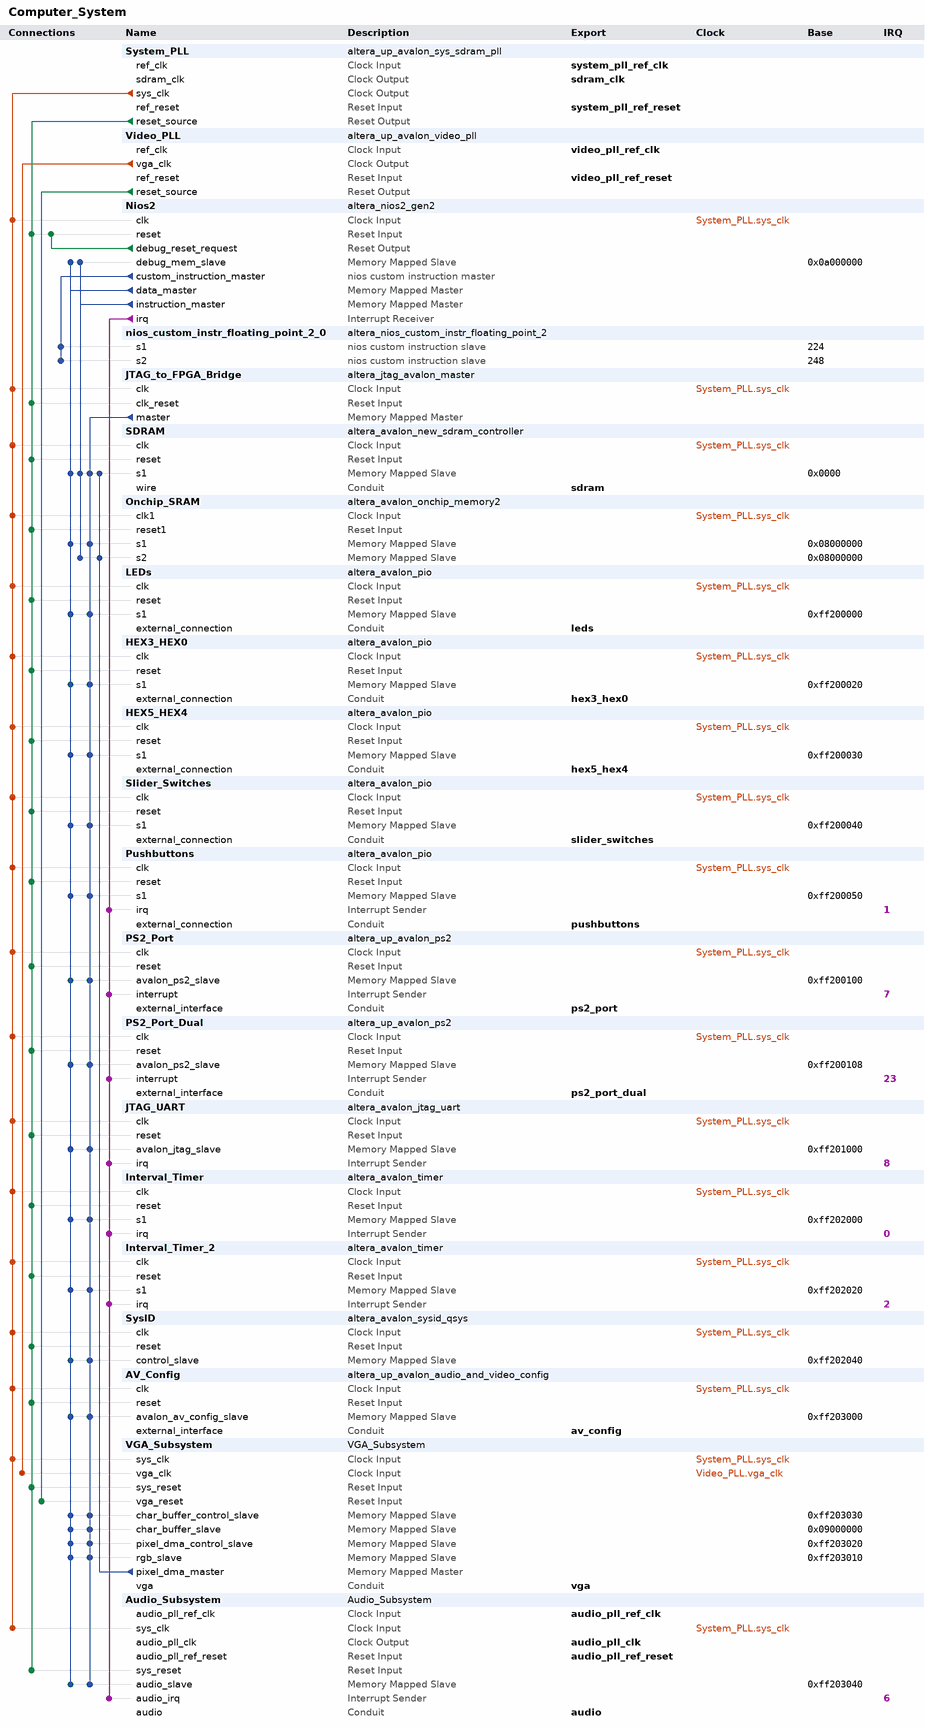
[diagram p0: system contents]
# Platform Designer (Qsys) system Computer_System, Cyclone V 5CSEMA5F31C6
# Parameters at their usual value, and those the tool derives, are not listed.
package require -exact qsys 18.1
create_system Computer_System
set_project_property DEVICE_FAMILY {Cyclone V}
set_project_property DEVICE 5CSEMA5F31C6

add_instance System_PLL altera_up_avalon_sys_sdram_pll 18.0
set_instance_parameter_value System_PLL CV_boards DE1-SoC
set_instance_parameter_value System_PLL gui_outclk 100.0
set_instance_parameter_value System_PLL gui_refclk 50.0

add_instance Video_PLL altera_up_avalon_video_pll 18.0
set_instance_parameter_value Video_PLL camera {5MP Digital Camera (THDB_D5M)}
set_instance_parameter_value Video_PLL gui_refclk 50.0
set_instance_parameter_value Video_PLL lcd {7" LCD on VEEK-MT and MTL/MTL2 Modules}

add_instance Nios2 altera_nios2_gen2 18.1
set_instance_parameter_value Nios2 dcache_size 0
set_instance_parameter_value Nios2 debug_datatrigger 2
set_instance_parameter_value Nios2 debug_hwbreakpoint 2
set_instance_parameter_value Nios2 debug_traceType instruction_trace
set_instance_parameter_value Nios2 dividerType srt2
set_instance_parameter_value Nios2 exceptionSlave SDRAM.s1
set_instance_parameter_value Nios2 icache_size 4096
set_instance_parameter_value Nios2 impl Fast
set_instance_parameter_value Nios2 mul_64_impl 1
set_instance_parameter_value Nios2 mul_shift_choice 1
set_instance_parameter_value Nios2 resetSlave SDRAM.s1
set_instance_parameter_value Nios2 resetrequest_enabled false
set_instance_parameter_value Nios2 setting_support31bitdcachebypass false

add_instance nios_custom_instr_floating_point_2_0 altera_nios_custom_instr_floating_point_2 18.1
set_instance_parameter_value nios_custom_instr_floating_point_2_0 arithmetic_present true
set_instance_parameter_value nios_custom_instr_floating_point_2_0 comparison_present true
set_instance_parameter_value nios_custom_instr_floating_point_2_0 conversion_present true
set_instance_parameter_value nios_custom_instr_floating_point_2_0 root_present true

add_instance JTAG_to_FPGA_Bridge altera_jtag_avalon_master 18.1

add_instance SDRAM altera_avalon_new_sdram_controller 18.1
set_instance_parameter_value SDRAM TAC 5.5
set_instance_parameter_value SDRAM TRCD 20.0
set_instance_parameter_value SDRAM TRP 20.0
set_instance_parameter_value SDRAM casLatency 3
set_instance_parameter_value SDRAM columnWidth 10
set_instance_parameter_value SDRAM dataWidth 16
set_instance_parameter_value SDRAM generateSimulationModel true
set_instance_parameter_value SDRAM model single_Micron_MT48LC4M32B2_7_chip
set_instance_parameter_value SDRAM numberOfBanks 4
set_instance_parameter_value SDRAM numberOfChipSelects 1
set_instance_parameter_value SDRAM powerUpDelay 100.0
set_instance_parameter_value SDRAM refreshPeriod 15.625
set_instance_parameter_value SDRAM rowWidth 13

add_instance Onchip_SRAM altera_avalon_onchip_memory2 18.1
set_instance_parameter_value Onchip_SRAM dataWidth 32
set_instance_parameter_value Onchip_SRAM dualPort true
set_instance_parameter_value Onchip_SRAM initMemContent true
set_instance_parameter_value Onchip_SRAM initializationFileName onchip_mem.hex
set_instance_parameter_value Onchip_SRAM memorySize 262144
set_instance_parameter_value Onchip_SRAM singleClockOperation true

add_instance LEDs altera_avalon_pio 18.1
set_instance_parameter_value LEDs direction Output
set_instance_parameter_value LEDs width 10

add_instance HEX3_HEX0 altera_avalon_pio 18.1
set_instance_parameter_value HEX3_HEX0 direction Output
set_instance_parameter_value HEX3_HEX0 width 32

add_instance HEX5_HEX4 altera_avalon_pio 18.1
set_instance_parameter_value HEX5_HEX4 direction Output
set_instance_parameter_value HEX5_HEX4 width 16

add_instance Slider_Switches altera_avalon_pio 18.1
set_instance_parameter_value Slider_Switches direction Input
set_instance_parameter_value Slider_Switches simDoTestBenchWiring true
set_instance_parameter_value Slider_Switches width 10

add_instance Pushbuttons altera_avalon_pio 18.1
set_instance_parameter_value Pushbuttons bitClearingEdgeCapReg true
set_instance_parameter_value Pushbuttons captureEdge true
set_instance_parameter_value Pushbuttons direction Input
set_instance_parameter_value Pushbuttons edgeType FALLING
set_instance_parameter_value Pushbuttons generateIRQ true
set_instance_parameter_value Pushbuttons irqType EDGE
set_instance_parameter_value Pushbuttons simDoTestBenchWiring true
set_instance_parameter_value Pushbuttons width 4

add_instance PS2_Port altera_up_avalon_ps2 18.0

add_instance PS2_Port_Dual altera_up_avalon_ps2 18.0

add_instance JTAG_UART altera_avalon_jtag_uart 18.1
set_instance_parameter_value JTAG_UART simInteractiveOptions NO_INTERACTIVE_WINDOWS

add_instance Interval_Timer altera_avalon_timer 18.1
set_instance_parameter_value Interval_Timer period 125.0
set_instance_parameter_value Interval_Timer periodUnits MSEC

add_instance Interval_Timer_2 altera_avalon_timer 18.1
set_instance_parameter_value Interval_Timer_2 period 125.0
set_instance_parameter_value Interval_Timer_2 periodUnits MSEC

add_instance SysID altera_avalon_sysid_qsys 18.1
set_instance_parameter_value SysID id 0

add_instance AV_Config altera_up_avalon_audio_and_video_config 18.0
set_instance_parameter_value AV_Config audio_in {Microphone to ADC}
set_instance_parameter_value AV_Config bit_length 32
set_instance_parameter_value AV_Config board DE1-SoC
set_instance_parameter_value AV_Config line_in_bypass true
set_instance_parameter_value AV_Config sampling_rate {8 kHz}

add_instance VGA_Subsystem VGA_Subsystem 1.0

add_instance Audio_Subsystem Audio_Subsystem 1.0

# connections
add_connection System_PLL.sys_clk Audio_Subsystem.sys_clk clock
add_connection System_PLL.sys_clk AV_Config.clk clock
add_connection System_PLL.sys_clk HEX3_HEX0.clk clock
add_connection System_PLL.sys_clk HEX5_HEX4.clk clock
add_connection System_PLL.sys_clk Interval_Timer.clk clock
add_connection System_PLL.sys_clk Interval_Timer_2.clk clock
add_connection System_PLL.sys_clk JTAG_to_FPGA_Bridge.clk clock
add_connection System_PLL.sys_clk JTAG_UART.clk clock
add_connection System_PLL.sys_clk LEDs.clk clock
add_connection System_PLL.sys_clk Nios2.clk clock
add_connection System_PLL.sys_clk Onchip_SRAM.clk1 clock
add_connection System_PLL.sys_clk PS2_Port.clk clock
add_connection System_PLL.sys_clk PS2_Port_Dual.clk clock
add_connection System_PLL.sys_clk Pushbuttons.clk clock
add_connection System_PLL.sys_clk SDRAM.clk clock
add_connection System_PLL.sys_clk Slider_Switches.clk clock
add_connection System_PLL.sys_clk SysID.clk clock
add_connection System_PLL.sys_clk VGA_Subsystem.sys_clk clock
add_connection Video_PLL.vga_clk VGA_Subsystem.vga_clk clock
add_connection Nios2.debug_reset_request Nios2.reset reset
add_connection System_PLL.reset_source Audio_Subsystem.sys_reset reset
add_connection System_PLL.reset_source AV_Config.reset reset
add_connection System_PLL.reset_source HEX3_HEX0.reset reset
add_connection System_PLL.reset_source HEX5_HEX4.reset reset
add_connection System_PLL.reset_source Interval_Timer.reset reset
add_connection System_PLL.reset_source Interval_Timer_2.reset reset
add_connection System_PLL.reset_source JTAG_to_FPGA_Bridge.clk_reset reset
add_connection System_PLL.reset_source JTAG_UART.reset reset
add_connection System_PLL.reset_source LEDs.reset reset
add_connection System_PLL.reset_source Nios2.reset reset
add_connection System_PLL.reset_source Onchip_SRAM.reset1 reset
add_connection System_PLL.reset_source PS2_Port.reset reset
add_connection System_PLL.reset_source PS2_Port_Dual.reset reset
add_connection System_PLL.reset_source Pushbuttons.reset reset
add_connection System_PLL.reset_source SDRAM.reset reset
add_connection System_PLL.reset_source Slider_Switches.reset reset
add_connection System_PLL.reset_source SysID.reset reset
add_connection System_PLL.reset_source VGA_Subsystem.sys_reset reset
add_connection Video_PLL.reset_source VGA_Subsystem.vga_reset reset
add_connection JTAG_to_FPGA_Bridge.master Audio_Subsystem.audio_slave avalon
set_connection_parameter_value JTAG_to_FPGA_Bridge.master/Audio_Subsystem.audio_slave baseAddress 0xff203040
add_connection JTAG_to_FPGA_Bridge.master AV_Config.avalon_av_config_slave avalon
set_connection_parameter_value JTAG_to_FPGA_Bridge.master/AV_Config.avalon_av_config_slave baseAddress 0xff203000
add_connection JTAG_to_FPGA_Bridge.master HEX3_HEX0.s1 avalon
set_connection_parameter_value JTAG_to_FPGA_Bridge.master/HEX3_HEX0.s1 baseAddress 0xff200020
add_connection JTAG_to_FPGA_Bridge.master HEX5_HEX4.s1 avalon
set_connection_parameter_value JTAG_to_FPGA_Bridge.master/HEX5_HEX4.s1 baseAddress 0xff200030
add_connection JTAG_to_FPGA_Bridge.master Interval_Timer.s1 avalon
set_connection_parameter_value JTAG_to_FPGA_Bridge.master/Interval_Timer.s1 baseAddress 0xff202000
add_connection JTAG_to_FPGA_Bridge.master Interval_Timer_2.s1 avalon
set_connection_parameter_value JTAG_to_FPGA_Bridge.master/Interval_Timer_2.s1 baseAddress 0xff202020
add_connection JTAG_to_FPGA_Bridge.master JTAG_UART.avalon_jtag_slave avalon
set_connection_parameter_value JTAG_to_FPGA_Bridge.master/JTAG_UART.avalon_jtag_slave baseAddress 0xff201000
add_connection JTAG_to_FPGA_Bridge.master LEDs.s1 avalon
set_connection_parameter_value JTAG_to_FPGA_Bridge.master/LEDs.s1 baseAddress 0xff200000
add_connection JTAG_to_FPGA_Bridge.master Onchip_SRAM.s1 avalon
set_connection_parameter_value JTAG_to_FPGA_Bridge.master/Onchip_SRAM.s1 baseAddress 0x08000000
add_connection JTAG_to_FPGA_Bridge.master PS2_Port.avalon_ps2_slave avalon
set_connection_parameter_value JTAG_to_FPGA_Bridge.master/PS2_Port.avalon_ps2_slave baseAddress 0xff200100
add_connection JTAG_to_FPGA_Bridge.master PS2_Port_Dual.avalon_ps2_slave avalon
set_connection_parameter_value JTAG_to_FPGA_Bridge.master/PS2_Port_Dual.avalon_ps2_slave baseAddress 0xff200108
add_connection JTAG_to_FPGA_Bridge.master Pushbuttons.s1 avalon
set_connection_parameter_value JTAG_to_FPGA_Bridge.master/Pushbuttons.s1 baseAddress 0xff200050
add_connection JTAG_to_FPGA_Bridge.master SDRAM.s1 avalon
set_connection_parameter_value JTAG_to_FPGA_Bridge.master/SDRAM.s1 baseAddress 0x0000
add_connection JTAG_to_FPGA_Bridge.master Slider_Switches.s1 avalon
set_connection_parameter_value JTAG_to_FPGA_Bridge.master/Slider_Switches.s1 baseAddress 0xff200040
add_connection JTAG_to_FPGA_Bridge.master SysID.control_slave avalon
set_connection_parameter_value JTAG_to_FPGA_Bridge.master/SysID.control_slave baseAddress 0xff202040
add_connection JTAG_to_FPGA_Bridge.master VGA_Subsystem.char_buffer_control_slave avalon
set_connection_parameter_value JTAG_to_FPGA_Bridge.master/VGA_Subsystem.char_buffer_control_slave baseAddress 0xff203030
add_connection JTAG_to_FPGA_Bridge.master VGA_Subsystem.char_buffer_slave avalon
set_connection_parameter_value JTAG_to_FPGA_Bridge.master/VGA_Subsystem.char_buffer_slave baseAddress 0x09000000
add_connection JTAG_to_FPGA_Bridge.master VGA_Subsystem.pixel_dma_control_slave avalon
set_connection_parameter_value JTAG_to_FPGA_Bridge.master/VGA_Subsystem.pixel_dma_control_slave baseAddress 0xff203020
add_connection JTAG_to_FPGA_Bridge.master VGA_Subsystem.rgb_slave avalon
set_connection_parameter_value JTAG_to_FPGA_Bridge.master/VGA_Subsystem.rgb_slave baseAddress 0xff203010
add_connection Nios2.data_master Audio_Subsystem.audio_slave avalon
set_connection_parameter_value Nios2.data_master/Audio_Subsystem.audio_slave baseAddress 0xff203040
add_connection Nios2.data_master AV_Config.avalon_av_config_slave avalon
set_connection_parameter_value Nios2.data_master/AV_Config.avalon_av_config_slave baseAddress 0xff203000
add_connection Nios2.data_master HEX3_HEX0.s1 avalon
set_connection_parameter_value Nios2.data_master/HEX3_HEX0.s1 baseAddress 0xff200020
add_connection Nios2.data_master HEX5_HEX4.s1 avalon
set_connection_parameter_value Nios2.data_master/HEX5_HEX4.s1 baseAddress 0xff200030
add_connection Nios2.data_master Interval_Timer.s1 avalon
set_connection_parameter_value Nios2.data_master/Interval_Timer.s1 baseAddress 0xff202000
add_connection Nios2.data_master Interval_Timer_2.s1 avalon
set_connection_parameter_value Nios2.data_master/Interval_Timer_2.s1 baseAddress 0xff202020
add_connection Nios2.data_master JTAG_UART.avalon_jtag_slave avalon
set_connection_parameter_value Nios2.data_master/JTAG_UART.avalon_jtag_slave baseAddress 0xff201000
add_connection Nios2.data_master LEDs.s1 avalon
set_connection_parameter_value Nios2.data_master/LEDs.s1 baseAddress 0xff200000
add_connection Nios2.data_master Nios2.debug_mem_slave avalon
set_connection_parameter_value Nios2.data_master/Nios2.debug_mem_slave baseAddress 0x0a000000
add_connection Nios2.data_master Onchip_SRAM.s1 avalon
set_connection_parameter_value Nios2.data_master/Onchip_SRAM.s1 baseAddress 0x08000000
add_connection Nios2.data_master PS2_Port.avalon_ps2_slave avalon
set_connection_parameter_value Nios2.data_master/PS2_Port.avalon_ps2_slave baseAddress 0xff200100
add_connection Nios2.data_master PS2_Port_Dual.avalon_ps2_slave avalon
set_connection_parameter_value Nios2.data_master/PS2_Port_Dual.avalon_ps2_slave baseAddress 0xff200108
add_connection Nios2.data_master Pushbuttons.s1 avalon
set_connection_parameter_value Nios2.data_master/Pushbuttons.s1 baseAddress 0xff200050
add_connection Nios2.data_master SDRAM.s1 avalon
set_connection_parameter_value Nios2.data_master/SDRAM.s1 baseAddress 0x0000
add_connection Nios2.data_master Slider_Switches.s1 avalon
set_connection_parameter_value Nios2.data_master/Slider_Switches.s1 baseAddress 0xff200040
add_connection Nios2.data_master SysID.control_slave avalon
set_connection_parameter_value Nios2.data_master/SysID.control_slave baseAddress 0xff202040
add_connection Nios2.data_master VGA_Subsystem.char_buffer_control_slave avalon
set_connection_parameter_value Nios2.data_master/VGA_Subsystem.char_buffer_control_slave baseAddress 0xff203030
add_connection Nios2.data_master VGA_Subsystem.char_buffer_slave avalon
set_connection_parameter_value Nios2.data_master/VGA_Subsystem.char_buffer_slave baseAddress 0x09000000
add_connection Nios2.data_master VGA_Subsystem.pixel_dma_control_slave avalon
set_connection_parameter_value Nios2.data_master/VGA_Subsystem.pixel_dma_control_slave baseAddress 0xff203020
add_connection Nios2.data_master VGA_Subsystem.rgb_slave avalon
set_connection_parameter_value Nios2.data_master/VGA_Subsystem.rgb_slave baseAddress 0xff203010
add_connection Nios2.instruction_master Nios2.debug_mem_slave avalon
set_connection_parameter_value Nios2.instruction_master/Nios2.debug_mem_slave baseAddress 0x0a000000
add_connection Nios2.instruction_master Onchip_SRAM.s2 avalon
set_connection_parameter_value Nios2.instruction_master/Onchip_SRAM.s2 baseAddress 0x08000000
add_connection Nios2.instruction_master SDRAM.s1 avalon
set_connection_parameter_value Nios2.instruction_master/SDRAM.s1 baseAddress 0x0000
add_connection VGA_Subsystem.pixel_dma_master Onchip_SRAM.s2 avalon
set_connection_parameter_value VGA_Subsystem.pixel_dma_master/Onchip_SRAM.s2 baseAddress 0x08000000
add_connection VGA_Subsystem.pixel_dma_master SDRAM.s1 avalon
set_connection_parameter_value VGA_Subsystem.pixel_dma_master/SDRAM.s1 baseAddress 0x0000
add_connection Nios2.irq Audio_Subsystem.audio_irq interrupt
set_connection_parameter_value Nios2.irq/Audio_Subsystem.audio_irq irqNumber 6
add_connection Nios2.irq Interval_Timer.irq interrupt
set_connection_parameter_value Nios2.irq/Interval_Timer.irq irqNumber 0
add_connection Nios2.irq Interval_Timer_2.irq interrupt
set_connection_parameter_value Nios2.irq/Interval_Timer_2.irq irqNumber 2
add_connection Nios2.irq JTAG_UART.irq interrupt
set_connection_parameter_value Nios2.irq/JTAG_UART.irq irqNumber 8
add_connection Nios2.irq PS2_Port.interrupt interrupt
set_connection_parameter_value Nios2.irq/PS2_Port.interrupt irqNumber 7
add_connection Nios2.irq PS2_Port_Dual.interrupt interrupt
set_connection_parameter_value Nios2.irq/PS2_Port_Dual.interrupt irqNumber 23
add_connection Nios2.irq Pushbuttons.irq interrupt
set_connection_parameter_value Nios2.irq/Pushbuttons.irq irqNumber 1
add_connection Nios2.custom_instruction_master nios_custom_instr_floating_point_2_0.s1 nios_custom_instruction
set_connection_parameter_value Nios2.custom_instruction_master/nios_custom_instr_floating_point_2_0.s1 CIName nios_custom_instr_floating_point_2_0_1
set_connection_parameter_value Nios2.custom_instruction_master/nios_custom_instr_floating_point_2_0.s1 baseAddress 224
add_connection Nios2.custom_instruction_master nios_custom_instr_floating_point_2_0.s2 nios_custom_instruction
set_connection_parameter_value Nios2.custom_instruction_master/nios_custom_instr_floating_point_2_0.s2 CIName nios_custom_instr_floating_point_2_0
set_connection_parameter_value Nios2.custom_instruction_master/nios_custom_instr_floating_point_2_0.s2 baseAddress 248

# exported interfaces
add_interface audio conduit end
set_interface_property audio EXPORT_OF Audio_Subsystem.audio
add_interface audio_pll_clk clock source
set_interface_property audio_pll_clk EXPORT_OF Audio_Subsystem.audio_pll_clk
add_interface audio_pll_ref_clk clock sink
set_interface_property audio_pll_ref_clk EXPORT_OF Audio_Subsystem.audio_pll_ref_clk
add_interface audio_pll_ref_reset reset sink
set_interface_property audio_pll_ref_reset EXPORT_OF Audio_Subsystem.audio_pll_ref_reset
add_interface av_config conduit end
set_interface_property av_config EXPORT_OF AV_Config.external_interface
add_interface hex3_hex0 conduit end
set_interface_property hex3_hex0 EXPORT_OF HEX3_HEX0.external_connection
add_interface hex5_hex4 conduit end
set_interface_property hex5_hex4 EXPORT_OF HEX5_HEX4.external_connection
add_interface leds conduit end
set_interface_property leds EXPORT_OF LEDs.external_connection
add_interface ps2_port conduit end
set_interface_property ps2_port EXPORT_OF PS2_Port.external_interface
add_interface ps2_port_dual conduit end
set_interface_property ps2_port_dual EXPORT_OF PS2_Port_Dual.external_interface
add_interface pushbuttons conduit end
set_interface_property pushbuttons EXPORT_OF Pushbuttons.external_connection
add_interface sdram conduit end
set_interface_property sdram EXPORT_OF SDRAM.wire
add_interface sdram_clk clock source
set_interface_property sdram_clk EXPORT_OF System_PLL.sdram_clk
add_interface slider_switches conduit end
set_interface_property slider_switches EXPORT_OF Slider_Switches.external_connection
add_interface system_pll_ref_clk clock sink
set_interface_property system_pll_ref_clk EXPORT_OF System_PLL.ref_clk
add_interface system_pll_ref_reset reset sink
set_interface_property system_pll_ref_reset EXPORT_OF System_PLL.ref_reset
add_interface vga conduit end
set_interface_property vga EXPORT_OF VGA_Subsystem.vga
add_interface video_pll_ref_clk clock sink
set_interface_property video_pll_ref_clk EXPORT_OF Video_PLL.ref_clk
add_interface video_pll_ref_reset reset sink
set_interface_property video_pll_ref_reset EXPORT_OF Video_PLL.ref_reset

set_interconnect_requirement {$system} qsys_mm.clockCrossingAdapter HANDSHAKE
set_interconnect_requirement {$system} qsys_mm.enableEccProtection FALSE
set_interconnect_requirement {$system} qsys_mm.insertDefaultSlave FALSE
set_interconnect_requirement {$system} qsys_mm.maxAdditionalLatency 1

save_system Computer_System.qsys
